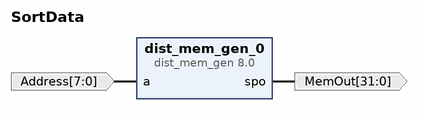
[diagram p0: block diagram of the top level]
# Vivado block design SortData, xc7a35tcpg236-3, Vivado 2018.3
create_bd_design SortData

create_bd_port -dir I -from 7 -to 0 Address
create_bd_port -dir O -from 31 -to 0 -type data MemOut

create_bd_cell -type ip -vlnv xilinx.com:ip:dist_mem_gen:8.0 dist_mem_gen_0
set_property -dict [list \
  CONFIG.coefficient_file ../../../../imports/Pipeline/SortData_dist_mem_gen_0_0.coe \
  CONFIG.data_width 32 \
  CONFIG.default_data_radix 16 \
  CONFIG.depth 256 \
  CONFIG.input_options non_registered \
  CONFIG.memory_type rom \
  CONFIG.output_options non_registered \
] [get_bd_cells dist_mem_gen_0]

# ---- connections ----

connect_bd_net [get_bd_ports Address] [get_bd_pins dist_mem_gen_0/a]
connect_bd_net [get_bd_pins dist_mem_gen_0/spo] [get_bd_ports MemOut]

validate_bd_design
save_bd_design
